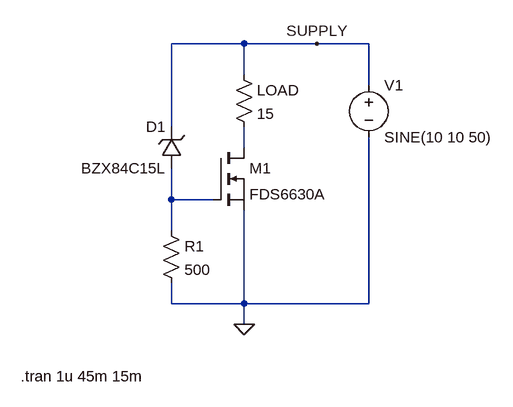
[diagram p0: schematic voltage-switch.asc]
voltage-switch.asc, the LTspice schematic file:
Version 4
SHEET 1 880 680
WIRE 416 80 304 80
WIRE 528 80 416 80
WIRE 608 80 528 80
WIRE 416 128 416 80
WIRE 608 144 608 80
WIRE 304 208 304 80
WIRE 416 240 416 208
WIRE 304 320 304 272
WIRE 368 320 304 320
WIRE 304 368 304 320
WIRE 304 480 304 448
WIRE 416 480 416 336
WIRE 416 480 304 480
WIRE 608 480 608 224
WIRE 608 480 416 480
WIRE 416 512 416 480
FLAG 416 512 0
FLAG 528 80 SUPPLY
SYMBOL nmos 368 240 R0
SYMATTR InstName M1
SYMATTR Value FDS6630A
SYMBOL zener 320 272 R180
WINDOW 0 24 64 Left 2
WINDOW 3 24 0 Left 2
SYMATTR InstName D1
SYMATTR Value BZX84C15L
SYMBOL res 288 352 R0
SYMATTR InstName R1
SYMATTR Value 500
SYMBOL res 400 112 R0
SYMATTR InstName LOAD
SYMATTR Value 15
SYMBOL voltage 608 128 R0
SYMATTR InstName V1
SYMATTR Value SINE(10 10 50)
TEXT 72 592 Left 2 !.tran 1u 45m 15m

The netlist it stands for:
* voltage-switch.asc
M1 N001 N002 0 0 FDS6630A
D1 N002 SUPPLY BZX84C15L
R1 N002 0 500
R§LOAD SUPPLY N001 15
V1 SUPPLY 0 SINE(10 10 50)
.model D D
.lib standard.dio
.model NMOS NMOS
.model PMOS PMOS
.lib standard.mos
.tran 1u 45m 15m
.backanno
.end